# Altium schematic sheet Schematic.SchDoc
size B; CompanyName: Microchip Technology Inc.; Organization: Microchip Technology; Address1: 2355 West Chandler Blvd.; Address2: Chandler, AZ  85224; Address4: USA; SheetNumber: 1; SheetTotal: 1; SheetTitle: **; Time: Time
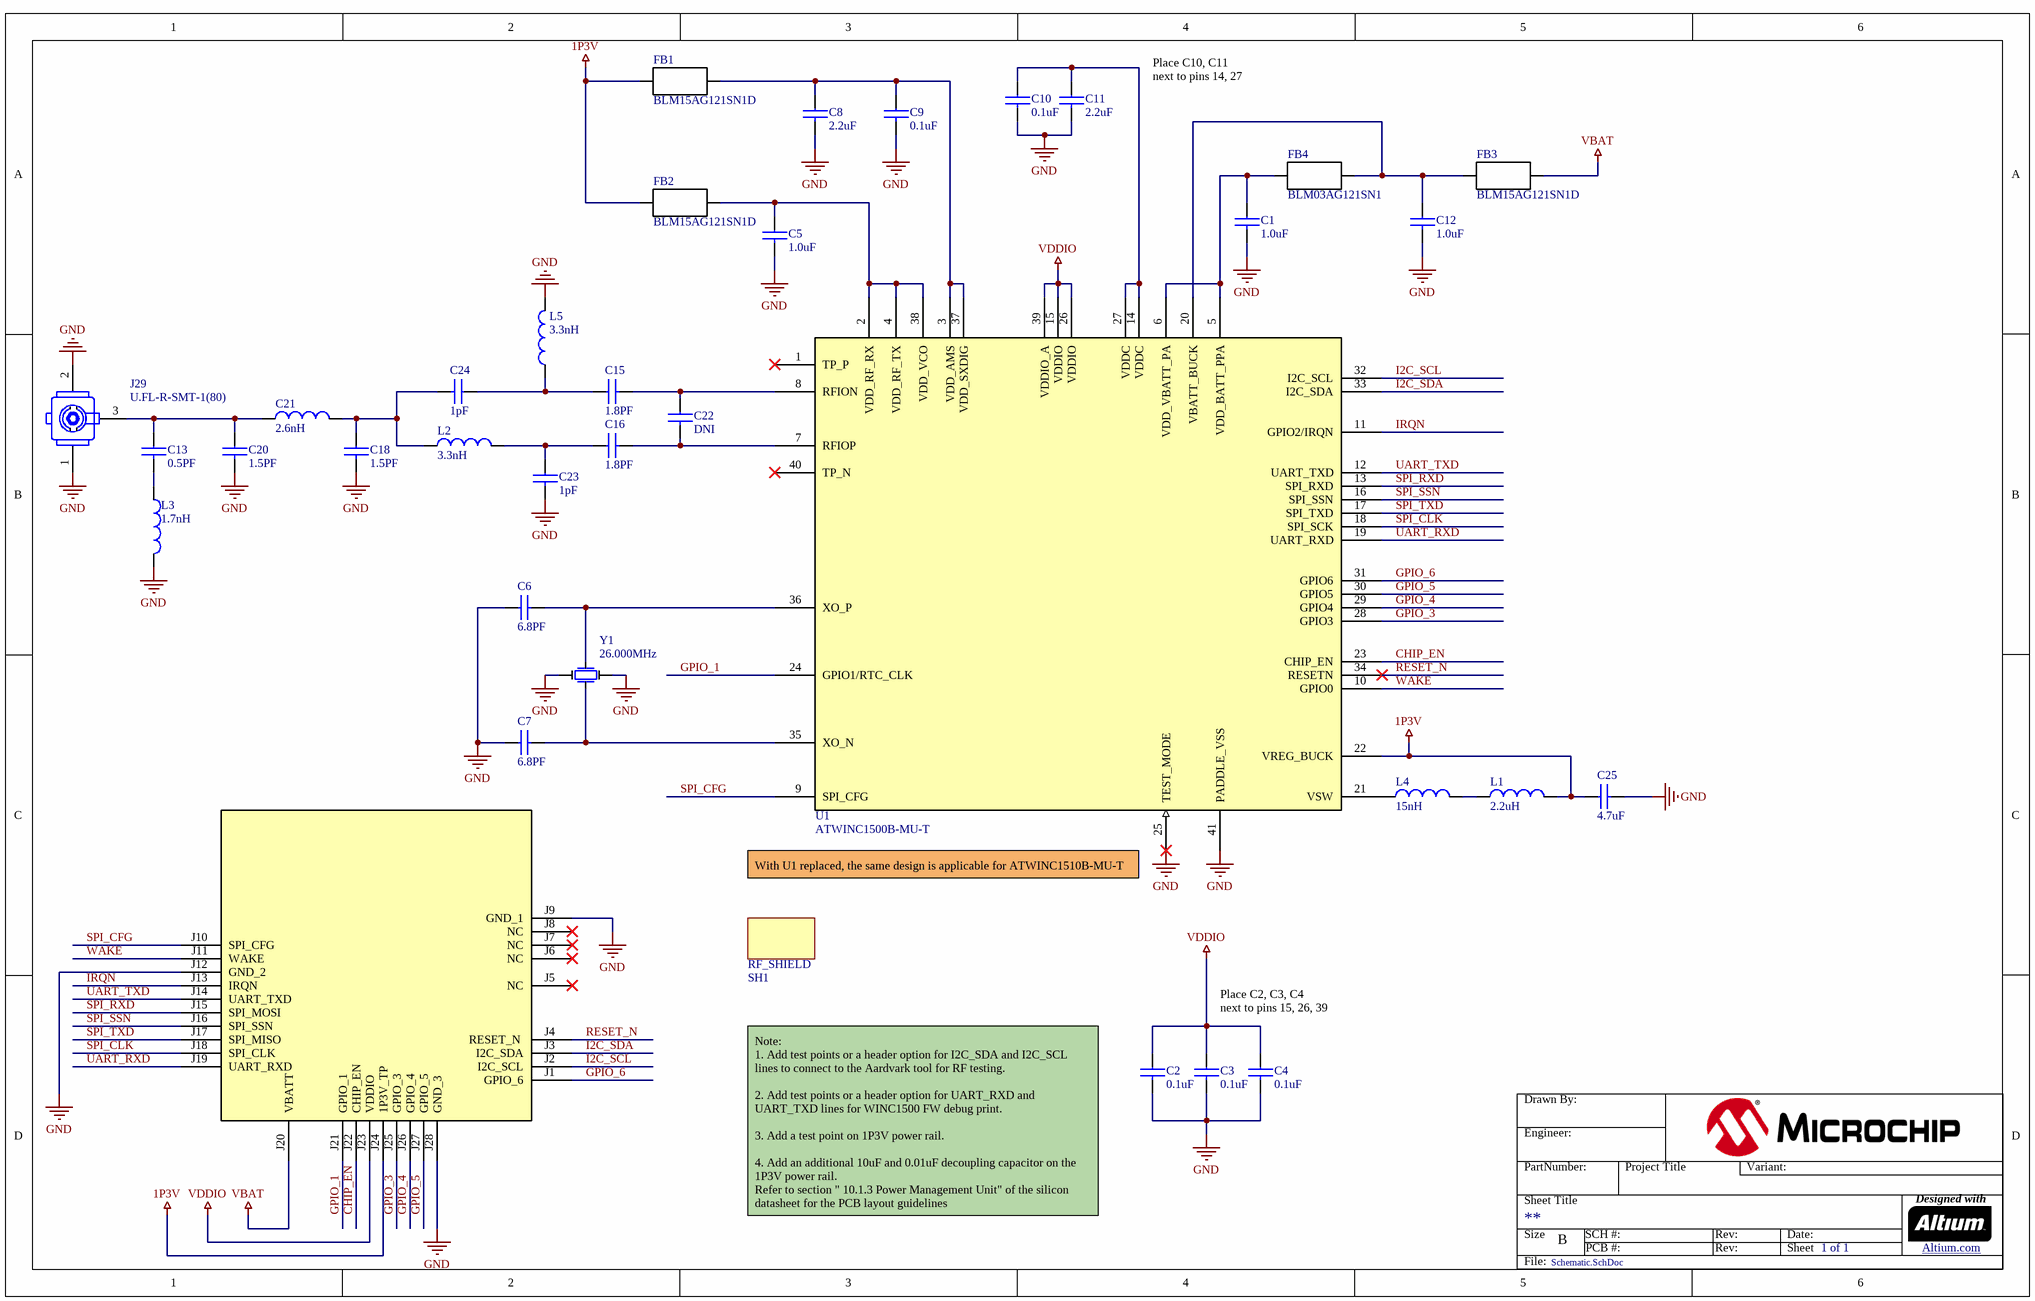
[diagram p0: Schematic.SchDoc]

## Parts
?  (no value)  (graphical)
C1  value 1.0uF  [C0201]  (hidden comment: CAP_1.0uF_0201)
C2  value 0.1uF  [0402_M]  (hidden comment: CAP_0.1uF_0402)
C3  value 0.1uF  [0402_M]  (hidden comment: CAP_0.1uF_0402)
C4  value 0.1uF  [0402_M]  (hidden comment: CAP_0.1uF_0402)
C5  value 1.0uF  [0402_M]  (hidden comment: CAP_1.0uF_0402)
C6  value 6.8PF  [0402_M]  (hidden comment: CAP_6.8pF_0402)
C7  value 6.8PF  [0402_M]  (hidden comment: CAP_6.8pF_0402)
C8  value 2.2uF  [0402_M]  (hidden comment: CAP_2.2uF_0402)
C9  value 0.1uF  [0402_M]  (hidden comment: CAP_0.1uF_0402)
C10  value 0.1uF  [0402_M]  (hidden comment: CAP_0.1uF_0402)
C11  value 2.2uF  [0402_M]  (hidden comment: CAP_2.2uF_0402)
C12  value 1.0uF  [0402_M]  (hidden comment: CAP_1.0uF_0402)
C13  value 0.5PF  [C0201]  (hidden comment: CAP_0.5pF_0201)
C15  value 1.8PF  [C0201]  (hidden comment: CAP_1.8pF_0201)
C16  value 1.8PF  [C0201]  (hidden comment: CAP_1.8pF_0201)
C18  value 1.5PF  [C0201]  (hidden comment: CAP_1.5pF_0201)
C20  value 1.5PF  [C0201]  (hidden comment: CAP_1.5pF_0201)
C21  value 2.6nH  [LQP03T_0201]  (hidden comment: IND_2.6nH)
C22  value DNI  [C0201]  (hidden comment: CAP_DNI)
C23  value 1pF  [C0201]  (hidden comment: CAP_1pF_0201)
C24  value 1pF  [C0201]  (hidden comment: CAP_1pF_0201)
C25  value 4.7uF  [0402_M]  (hidden comment: CAP_4.7uF_0402)
FB1  value BLM15AG121SN1D  [FB_M]  (hidden comment: FB_BLM15AG121SN1)
FB2  value BLM15AG121SN1D  [FB_M]  (hidden comment: FB_BLM15AG121SN1)
FB3  value BLM15AG121SN1D  [FB_M]  (hidden comment: FB_BLM15AG121SN1)
FB4  value BLM03AG121SN1  [LQP03T_0201]  (hidden comment: FB_BLM03AG121SN1D)
J29  value U.FL-R-SMT-1(80)  [RECT_U_FL-R-SMT]  (hidden comment: U.FL-R-SMT)
L1  value 2.2uH  [0603_M]  (hidden comment: IND_2.2uH)
L2  value 3.3nH  [LQP03T_0201]  (hidden comment: IND_3.3nH)
L3  value 1.7nH  [LQP03T_0201]  (hidden comment: IND_1.7nH)
L4  value 15nH  [0402_M]  (hidden comment: IND_15nH)
L5  value 3.3nH  [LQP03T_0201]  (hidden comment: IND_3.3nH)
PCB5  WINC1500_Module_PAD  [module footprint]  (value not drawn)  (no BOM)
SH1  RF_SHIELD  (value not drawn)  (mechanical)
U1  ATWINC1500B-MU-T  [QFN-40-5X5-P4-HP85]
Y1  value 26.000MHz  [FCX-05]  (hidden comment: 26MHz_XTAL)

## Nets
1P3V: C25.1 FB1.1 FB2.1 L1.2 PCB5.J24(1P3V_TP) U1.22(VREG_BUCK)
GND: C1.2 C2.2 C3.2 C4.2 C5.2 C6.1 C7.1 C8.2 C9.2 C10.2 C11.2 C12.2 C18.2 C20.2 C23.2 C25.2 J29.1(GND) J29.2(GND) L3.2 L5.2 PCB5.J9(GND_1) PCB5.J12(GND_2) PCB5.J28(GND_3) U1.25(TEST_MODE) U1.41(PADDLE_VSS) Y1.2 Y1.4
VBAT: FB3.1 PCB5.J20(VBATT)
VDDIO: C2.1 C3.1 C4.1 PCB5.J23(VDDIO) U1.15(VDDIO) U1.26(VDDIO) U1.39(VDDIO_A)
CHIP_EN: PCB5.J22(CHIP_EN) U1.23(CHIP_EN)
GPIO_1: PCB5.J21(GPIO_1) U1.24(GPIO1/RTC_CLK)
GPIO_3: PCB5.J25(GPIO_3) U1.28(GPIO3)
GPIO_4: PCB5.J26(GPIO_4) U1.29(GPIO4)
GPIO_5: PCB5.J27(GPIO_5) U1.30(GPIO5)
GPIO_6: PCB5.J1(GPIO_6) U1.31(GPIO6)
I2C_SCL: PCB5.J2(I2C_SCL) U1.32(I2C_SCL)
I2C_SDA: PCB5.J3(I2C_SDA) U1.33(I2C_SDA)
IRQN: PCB5.J13(IRQN) U1.11(GPIO2/IRQN)
RESET_N: PCB5.J4(RESET_N) U1.34(RESETN)
SPI_CFG: PCB5.J10(SPI_CFG) U1.9(SPI_CFG)
SPI_CLK: PCB5.J18(SPI_CLK) U1.18(SPI_SCK)
SPI_RXD: PCB5.J15(SPI_MOSI) U1.13(SPI_RXD)
SPI_SSN: PCB5.J16(SPI_SSN) U1.16(SPI_SSN)
SPI_TXD: PCB5.J17(SPI_MISO) U1.17(SPI_TXD)
UART_RXD: PCB5.J19(UART_RXD) U1.19(UART_RXD)
UART_TXD: PCB5.J14(UART_TXD) U1.12(UART_TXD)
WAKE: PCB5.J11(WAKE) U1.10(GPIO0)
NetC1_1: C1.1 FB4.1 U1.5(VDD_BATT_PPA) U1.6(VDD_VBATT_PA)
NetC5_1: C5.1 FB2.2 U1.2(VDD_RF_RX) U1.4(VDD_RF_TX) U1.38(VDD_VCO)
NetC6_2: C6.2 U1.36(XO_P) Y1.3
NetC7_2: C7.2 U1.35(XO_N) Y1.1
NetC8_1: C8.1 C9.1 FB1.2 U1.3(VDD_AMS) U1.37(VDD_SXDIG)
NetC10_1: C10.1 C11.1 U1.14(VDDC) U1.27(VDDC)
NetC12_1: C12.1 FB3.2 FB4.2 U1.20(VBATT_BUCK)
NetC13_1: C13.1 C20.1 C21.1 J29.3(SIG)
NetC13_2: C13.2 L3.1
NetC15_1: C15.1 C24.1 L5.1
NetC15_2: C15.2 C22.1 U1.8(RFION)
NetC16_1: C16.1 C23.1 L2.2
NetC16_2: C16.2 C22.2 U1.7(RFIOP)
NetC18_1: C18.1 C21.2 C24.2 L2.1
NetL1_1: L1.1 L4.2
NetL4_1: L4.1 U1.21(VSW)

Not connected (* = marked no-connect by the designer): PCB5 J5(NC)* J6(NC)* J7(NC)* J8(NC)*; U1 1(TP_P)* 40(TP_N)*

## Notes on the sheet
- Place C10, C11
  next to pins 14, 27
- With U1 replaced, the same design is applicable for ATWINC1510B-MU-T
- Place C2, C3, C4
  next to pins 15, 26, 39
- Note:
  1. Add test points or a header option for I2C_SDA and I2C_SCL lines to connect to the Aardvark tool for RF testing.
  2. Add test points or a header option for UART_RXD and UART_TXD lines for WINC1500 FW debug print.
  3. Add a test point on 1P3V power rail.
  4. Add an additional 10uF and 0.01uF decoupling capacitor on the 1P3V power rail.
  Refer to section " 10.1.3 Power Management Unit" of the silicon datasheet for the PCB layout guidelines
- Drawn By:
- Engineer:
- PartNumber:
- Project Title
- Variant:
- Sheet Title
- Size
- B
- SCH #:
- PCB #:
- Rev:
- Date:
- Sheet
- Designed with
- Altium.com <http://go.altium.com/MicrochipLandingPage_Evaluation.html>
- File:

## Library data of the parts
? = Title Block B
C1 = CAP_1.0uF_0201: SMT CAP 1.0uF 4V 20% X6S 0201; Manufacturer: Murata; Part Number: GRM033C80G105MEA2D
C2-C4 C9 C10 = CAP_0.1uF_0402: SMT CAP CER 100NF 16V 10% X5R 0402; Manufacturer: Yageo; Part Number: CC0402KRX5R7BB104
C5 C12 = CAP_1.0uF_0402: SMT CAP CER 1.0uF X5R 6.3V 0402 10%; Manufacturer: Yageo; Part Number: CC0402KRX5R5BB105
C6 C7 = CAP_6.8pF_0402: SMT CAP 6.8pF 0.5pF 50V 0402 COG; Manufacturer: Murata; Part Number: GRM1555C1H6R8D
C8 C11 = CAP_2.2uF_0402: SMT CAP 2.2uF 6.3V X5R 0402; Manufacturer: Taiyo; Part Number: JMK105BJ225MV
C13 = CAP_0.5pF_0201: SMT CAP CER 0.5pF 0.1pF NPO 0201 25V; Manufacturer: Murata; Part Number: GRM0335C1ER50BA0
C15 C16 = CAP_1.8pF_0201: SMT CAP CER 1.8PF 50V NP0 0201; Manufacturer: Murata; Part Number: GRM0335C1H1R8CA01D
C18 C20 = CAP_1.5pF_0201: SMT CAP CER 1.8PF 50V NP0 0201; Manufacturer: Murata; Part Number: GRM0335C1H1R5CA01
C21 = IND_2.6nH: IND 2.6NH 500MA 0201; Manufacturer: Murata; Part Number: LQP03TN2N6B02
C23 C24 = CAP_1pF_0201: SMT CAP 1pF 50V 0201 ±0.25pF COG; Manufacturer: Murata; Part Number: GRM0335C1H1R0CA01D
C25 = CAP_4.7uF_0402: SMT CAP CER 4.7UF 6.3V X5R 20% 0402; Manufacturer: Murata; Part Number: GRM155R60G475ME47D
FB1-FB3 = FB_BLM15AG121SN1: SMT IND 120 OHM 0402; Manufacturer: Murata; Part Number: BLM15AG121SN1D
FB4 = FB_BLM03AG121SN1D: SMT Ferrite 120 OHM 200mA 0201; Manufacturer: Murata; Part Number: BLM03AG121SN1
J29 = U.FL-R-SMT: SMT CONN RECPT ULTRA-MINI COAX; Manufacturer: HIROSE; Part Number: U.FL-R-SMT-1(80)
L1 = IND_2.2uH: SMT IND POWER 2.2uH 1250mA 0.22ohms 0603 20%; Manufacturer: Murata; Part Number: LQM18PN2R2MFRL
L2 L5 = IND_3.3nH: SMT IND 3.3+/-0.1NH 750MA 0201; Manufacturer: Murata; Part Number: LQP03TN3N3B02D
L3 = IND_1.7nH: SMT FIXED IND 1.7nH 600MA 150 MOHM; Manufacturer: Murata; Part Number: LQP03TN1N7B02
L4 = IND_15nH: SMT IND 15NH 5% 0402; Manufacturer: Murata; Part Number: LQG15HS15NJ02D
PCB5 = WINC1500_Module_PAD: Castalled_Pads; System: Connector
SH1 = RF_SHIELD: RF SHIELD (12.70 x 13.66 x 1.3 mm)
U1 = ATWINC1500B-MU-T: SMT IC WiFi 40QFN; Manufacturer: Microchip Technology; Value: ATWINC1500B-MU-T; Part Number: ATWINC1500B-MU-T
Y1 = 26MHz_XTAL: SMT CRYSTAL 26MHz; Manufacturer: Taitien; Part Number: A0183-X-001-3(M)